# EAGLE schematic battery_Fuel_Gauge_max17048 (EAGLE 6.1)
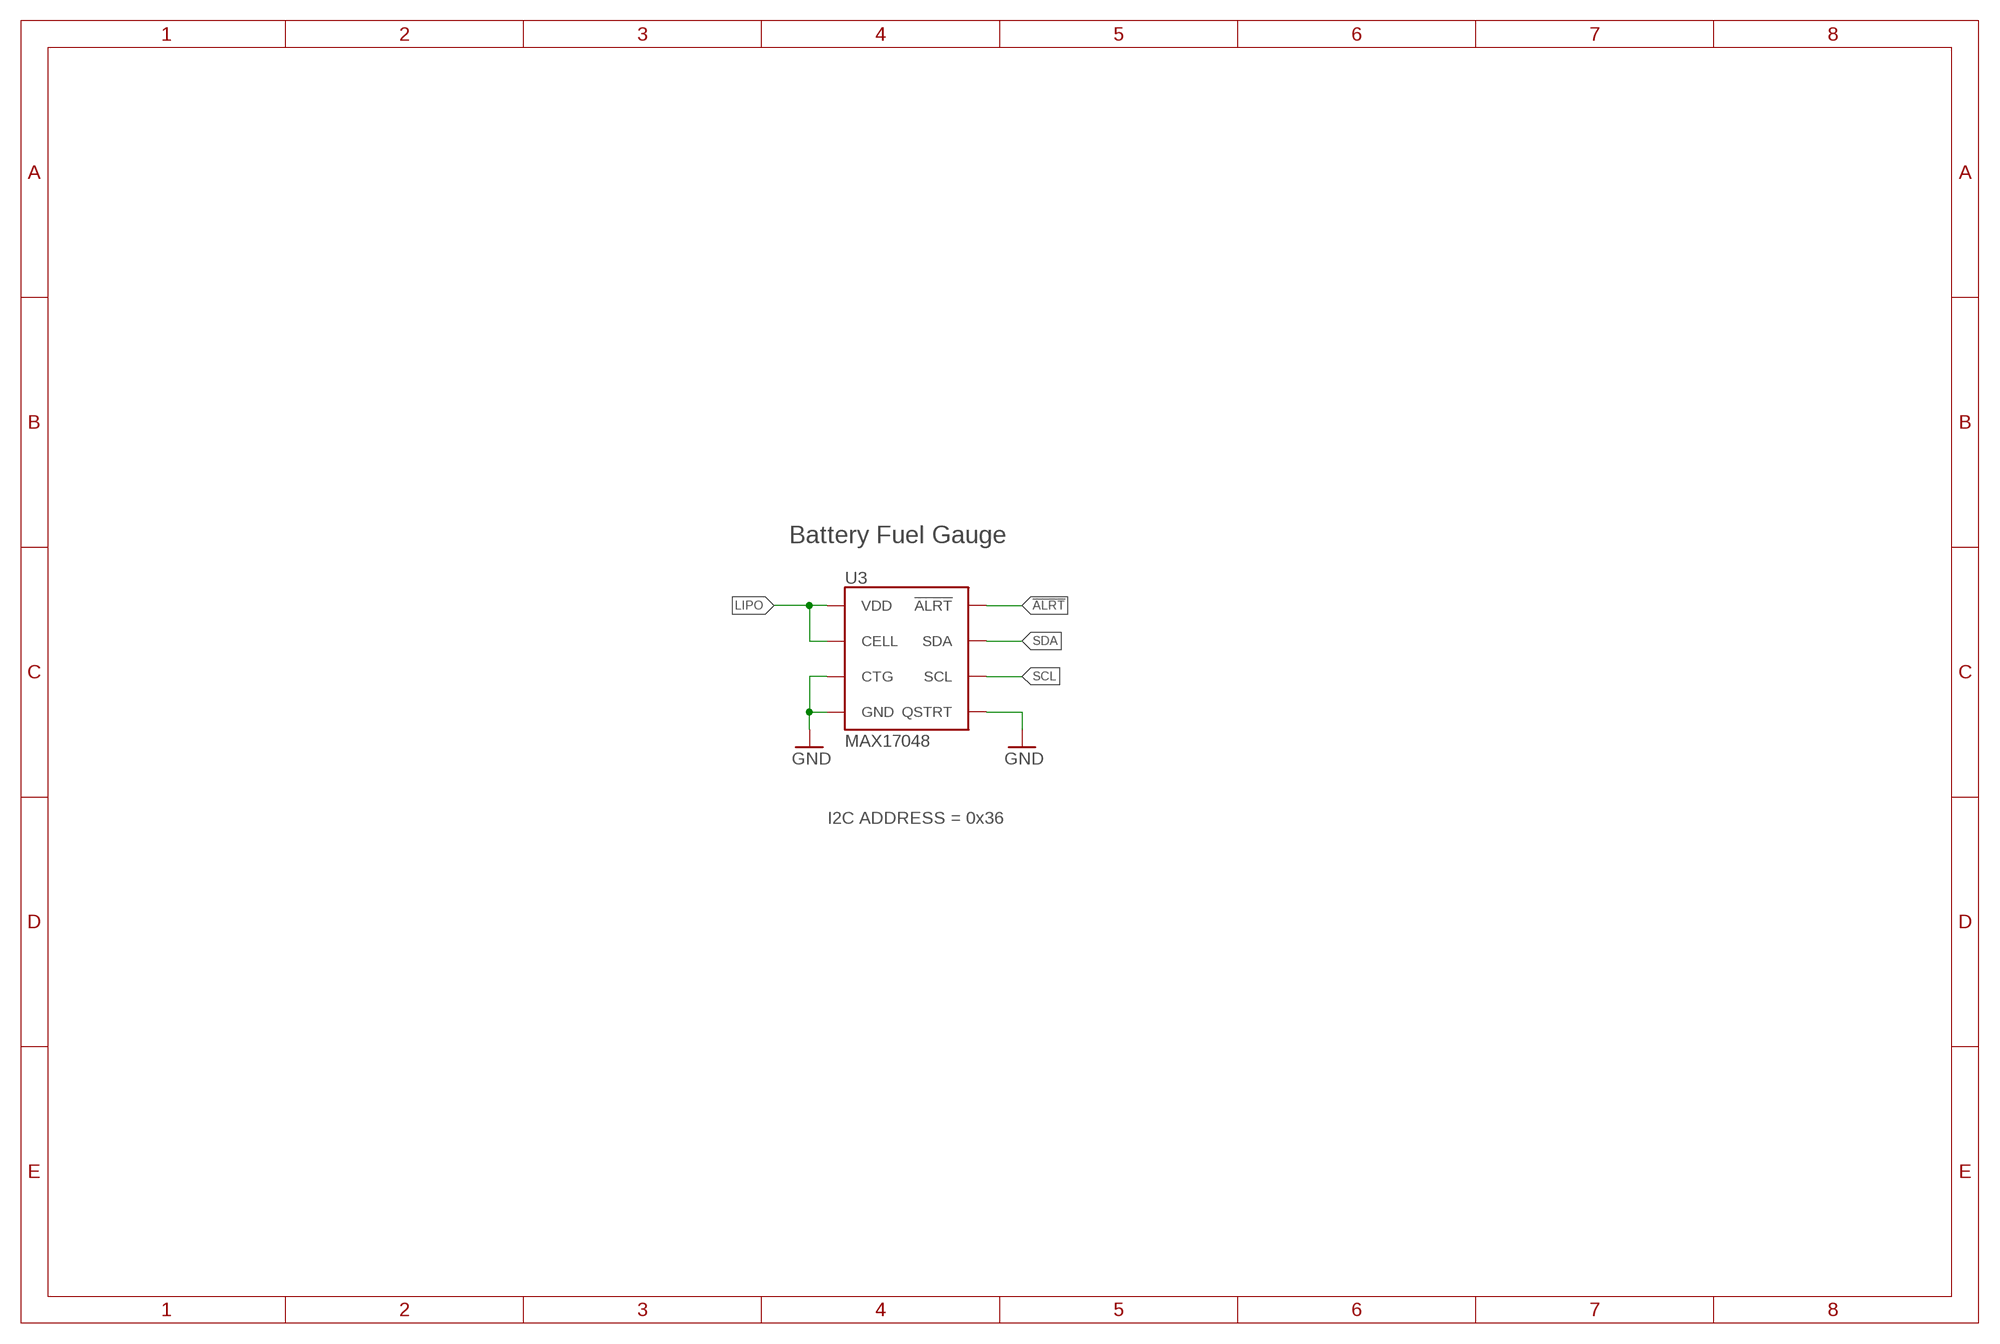
[diagram p0: schematic, sheet 1]

## Parts
U3  MAX17048  MAX17048DFN8  [DFN-8]

## Nets
!ALRT: U3.P$5(!ALRT)
GND: U3.P$1(CTG) U3.P$4(GND) U3.P$6(QSTRT) U3.P$9(GND)
LIPO: U3.P$2(CELL) U3.P$3(VDD)
SCL: U3.P$7(SCL)
SDA: U3.P$8(SDA)

## Notes on the sheet
- Battery Fuel Gauge
- I2C ADDRESS = 0x36

## Library data of the parts
U3 = SparkFun-DigitalIC:MAX17048: Micropower 1-Cell Li+ ModelGauge; PROD_ID: IC-12551